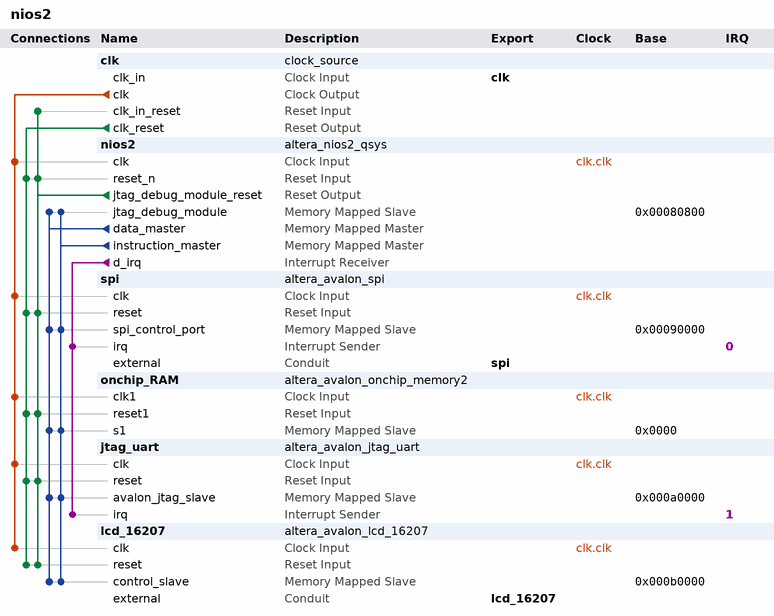
[diagram p0: system contents]
# Platform Designer (Qsys) system nios2, Cyclone IV GX Unknown
# Parameters at their usual value, and those the tool derives, are not listed.
package require -exact qsys 13.0.1.99.2
create_system nios2
set_project_property DEVICE_FAMILY {Cyclone IV GX}
set_project_property DEVICE Unknown

add_instance clk clock_source 13.0
set_instance_parameter_value clk clockFrequency 50000000

add_instance nios2 altera_nios2_qsys 13.0
set_instance_parameter_value nios2 resetSlave Absolute
set_instance_parameter_value nios2 mmu_TLBMissExcSlave None
set_instance_parameter_value nios2 exceptionSlave Absolute
set_instance_parameter_value nios2 breakSlave nios2.jtag_debug_module
set_instance_parameter_value nios2 impl Tiny
set_instance_parameter_value nios2 icache_size 4096

add_instance spi altera_avalon_spi 13.0.1.99.2
set_instance_parameter_value spi clockPolarity 0
set_instance_parameter_value spi dataWidth 8
set_instance_parameter_value spi masterSPI true
set_instance_parameter_value spi numberOfSlaves 4
set_instance_parameter_value spi targetClockRate 20000000

add_instance onchip_RAM altera_avalon_onchip_memory2 13.0.1.99.2
set_instance_parameter_value onchip_RAM dataWidth 32
set_instance_parameter_value onchip_RAM dualPort false
set_instance_parameter_value onchip_RAM initMemContent false
set_instance_parameter_value onchip_RAM initializationFileName onchip_mem.hex
set_instance_parameter_value onchip_RAM memorySize 524288

add_instance jtag_uart altera_avalon_jtag_uart 13.0.1.99.2
set_instance_parameter_value jtag_uart simInteractiveOptions NO_INTERACTIVE_WINDOWS
set_instance_parameter_value jtag_uart writeBufferDepth 256

add_instance lcd_16207 altera_avalon_lcd_16207 13.0.1.99.2

# connections
add_connection clk.clk jtag_uart.clk clock
add_connection clk.clk lcd_16207.clk clock
add_connection clk.clk nios2.clk clock
add_connection clk.clk onchip_RAM.clk1 clock
add_connection clk.clk spi.clk clock
add_connection clk.clk_reset jtag_uart.reset reset
add_connection clk.clk_reset lcd_16207.reset reset
add_connection clk.clk_reset nios2.reset_n reset
add_connection clk.clk_reset onchip_RAM.reset1 reset
add_connection clk.clk_reset spi.reset reset
add_connection nios2.jtag_debug_module_reset clk.clk_in_reset reset
add_connection nios2.jtag_debug_module_reset jtag_uart.reset reset
add_connection nios2.jtag_debug_module_reset lcd_16207.reset reset
add_connection nios2.jtag_debug_module_reset nios2.reset_n reset
add_connection nios2.jtag_debug_module_reset onchip_RAM.reset1 reset
add_connection nios2.jtag_debug_module_reset spi.reset reset
add_connection nios2.data_master jtag_uart.avalon_jtag_slave avalon
set_connection_parameter_value nios2.data_master/jtag_uart.avalon_jtag_slave baseAddress 0x000a0000
add_connection nios2.data_master lcd_16207.control_slave avalon
set_connection_parameter_value nios2.data_master/lcd_16207.control_slave baseAddress 0x000b0000
add_connection nios2.data_master nios2.jtag_debug_module avalon
set_connection_parameter_value nios2.data_master/nios2.jtag_debug_module baseAddress 0x00080800
add_connection nios2.data_master onchip_RAM.s1 avalon
set_connection_parameter_value nios2.data_master/onchip_RAM.s1 baseAddress 0x0000
add_connection nios2.data_master spi.spi_control_port avalon
set_connection_parameter_value nios2.data_master/spi.spi_control_port baseAddress 0x00090000
add_connection nios2.instruction_master jtag_uart.avalon_jtag_slave avalon
set_connection_parameter_value nios2.instruction_master/jtag_uart.avalon_jtag_slave baseAddress 0x000a0000
add_connection nios2.instruction_master lcd_16207.control_slave avalon
set_connection_parameter_value nios2.instruction_master/lcd_16207.control_slave baseAddress 0x000b0000
add_connection nios2.instruction_master nios2.jtag_debug_module avalon
set_connection_parameter_value nios2.instruction_master/nios2.jtag_debug_module baseAddress 0x00080800
add_connection nios2.instruction_master onchip_RAM.s1 avalon
set_connection_parameter_value nios2.instruction_master/onchip_RAM.s1 baseAddress 0x0000
add_connection nios2.instruction_master spi.spi_control_port avalon
set_connection_parameter_value nios2.instruction_master/spi.spi_control_port baseAddress 0x00090000
add_connection nios2.d_irq jtag_uart.irq interrupt
set_connection_parameter_value nios2.d_irq/jtag_uart.irq irqNumber 1
add_connection nios2.d_irq spi.irq interrupt
set_connection_parameter_value nios2.d_irq/spi.irq irqNumber 0

# exported interfaces
add_interface clk clock sink
set_interface_property clk EXPORT_OF clk.clk_in
add_interface spi conduit end
set_interface_property spi EXPORT_OF spi.external
add_interface lcd_16207 conduit end
set_interface_property lcd_16207 EXPORT_OF lcd_16207.external

set_interconnect_requirement {$system} qsys_mm.clockCrossingAdapter HANDSHAKE
set_interconnect_requirement {$system} qsys_mm.maxAdditionalLatency 1

save_system nios2.qsys
